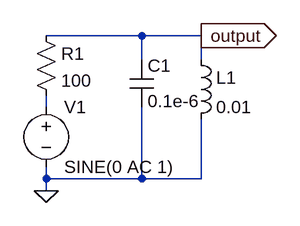
[diagram p0: schematic rlc_bandstop.asc]
rlc_bandstop.asc, the LTspice schematic file:
Version 4
SHEET 1 880 680
WIRE 192 64 64 64
WIRE 272 64 192 64
WIRE 192 96 192 64
WIRE 272 96 272 64
WIRE 64 160 64 144
WIRE 64 256 64 240
WIRE 192 256 192 160
WIRE 192 256 64 256
WIRE 272 256 272 176
WIRE 272 256 192 256
WIRE 64 272 64 256
FLAG 64 272 0
FLAG 272 64 output
IOPIN 272 64 Out
SYMBOL voltage 64 144 R0
WINDOW 123 0 0 Left 0
WINDOW 39 0 0 Left 0
SYMATTR InstName V1
SYMATTR Value SINE(0 AC 1)
SYMBOL res 48 48 R0
SYMATTR InstName R1
SYMATTR Value 100
SYMBOL cap 176 96 R0
SYMATTR InstName C1
SYMATTR Value 0.1e-6
SYMBOL ind 256 80 R0
SYMATTR InstName L1
SYMATTR Value 0.01

The netlist it stands for:
* rlc_bandstop.asc
V1 N001 0 SINE(0 AC 1)
R1 output N001 100
C1 output 0 0.1e-6
L1 output 0 0.01
.backanno
.end